# EAGLE design drone_synth (EAGLE 5.07)
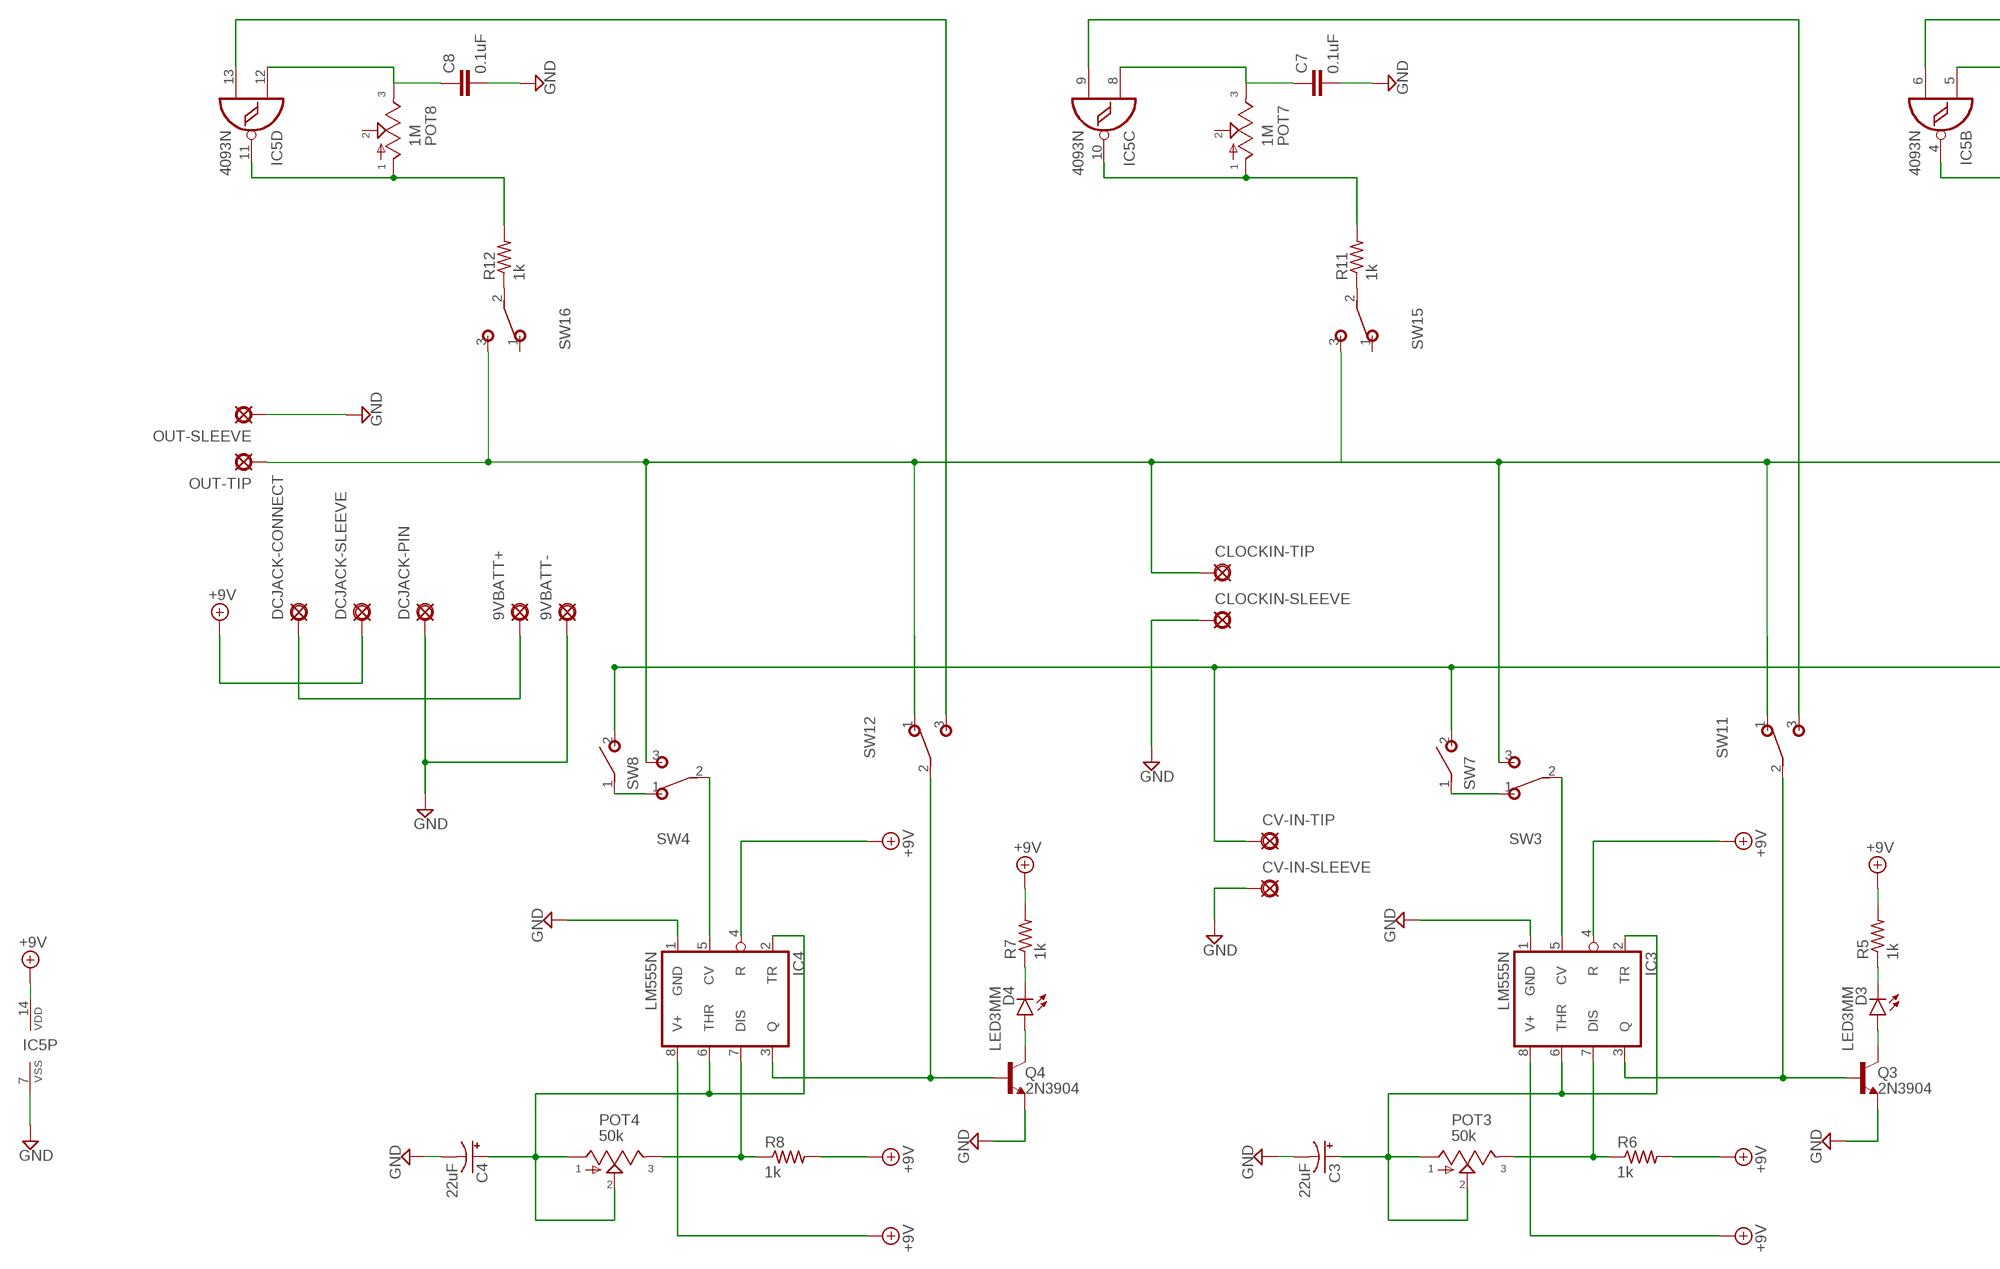
[diagram p0: schematic, sheet 1, part 1 of 2]
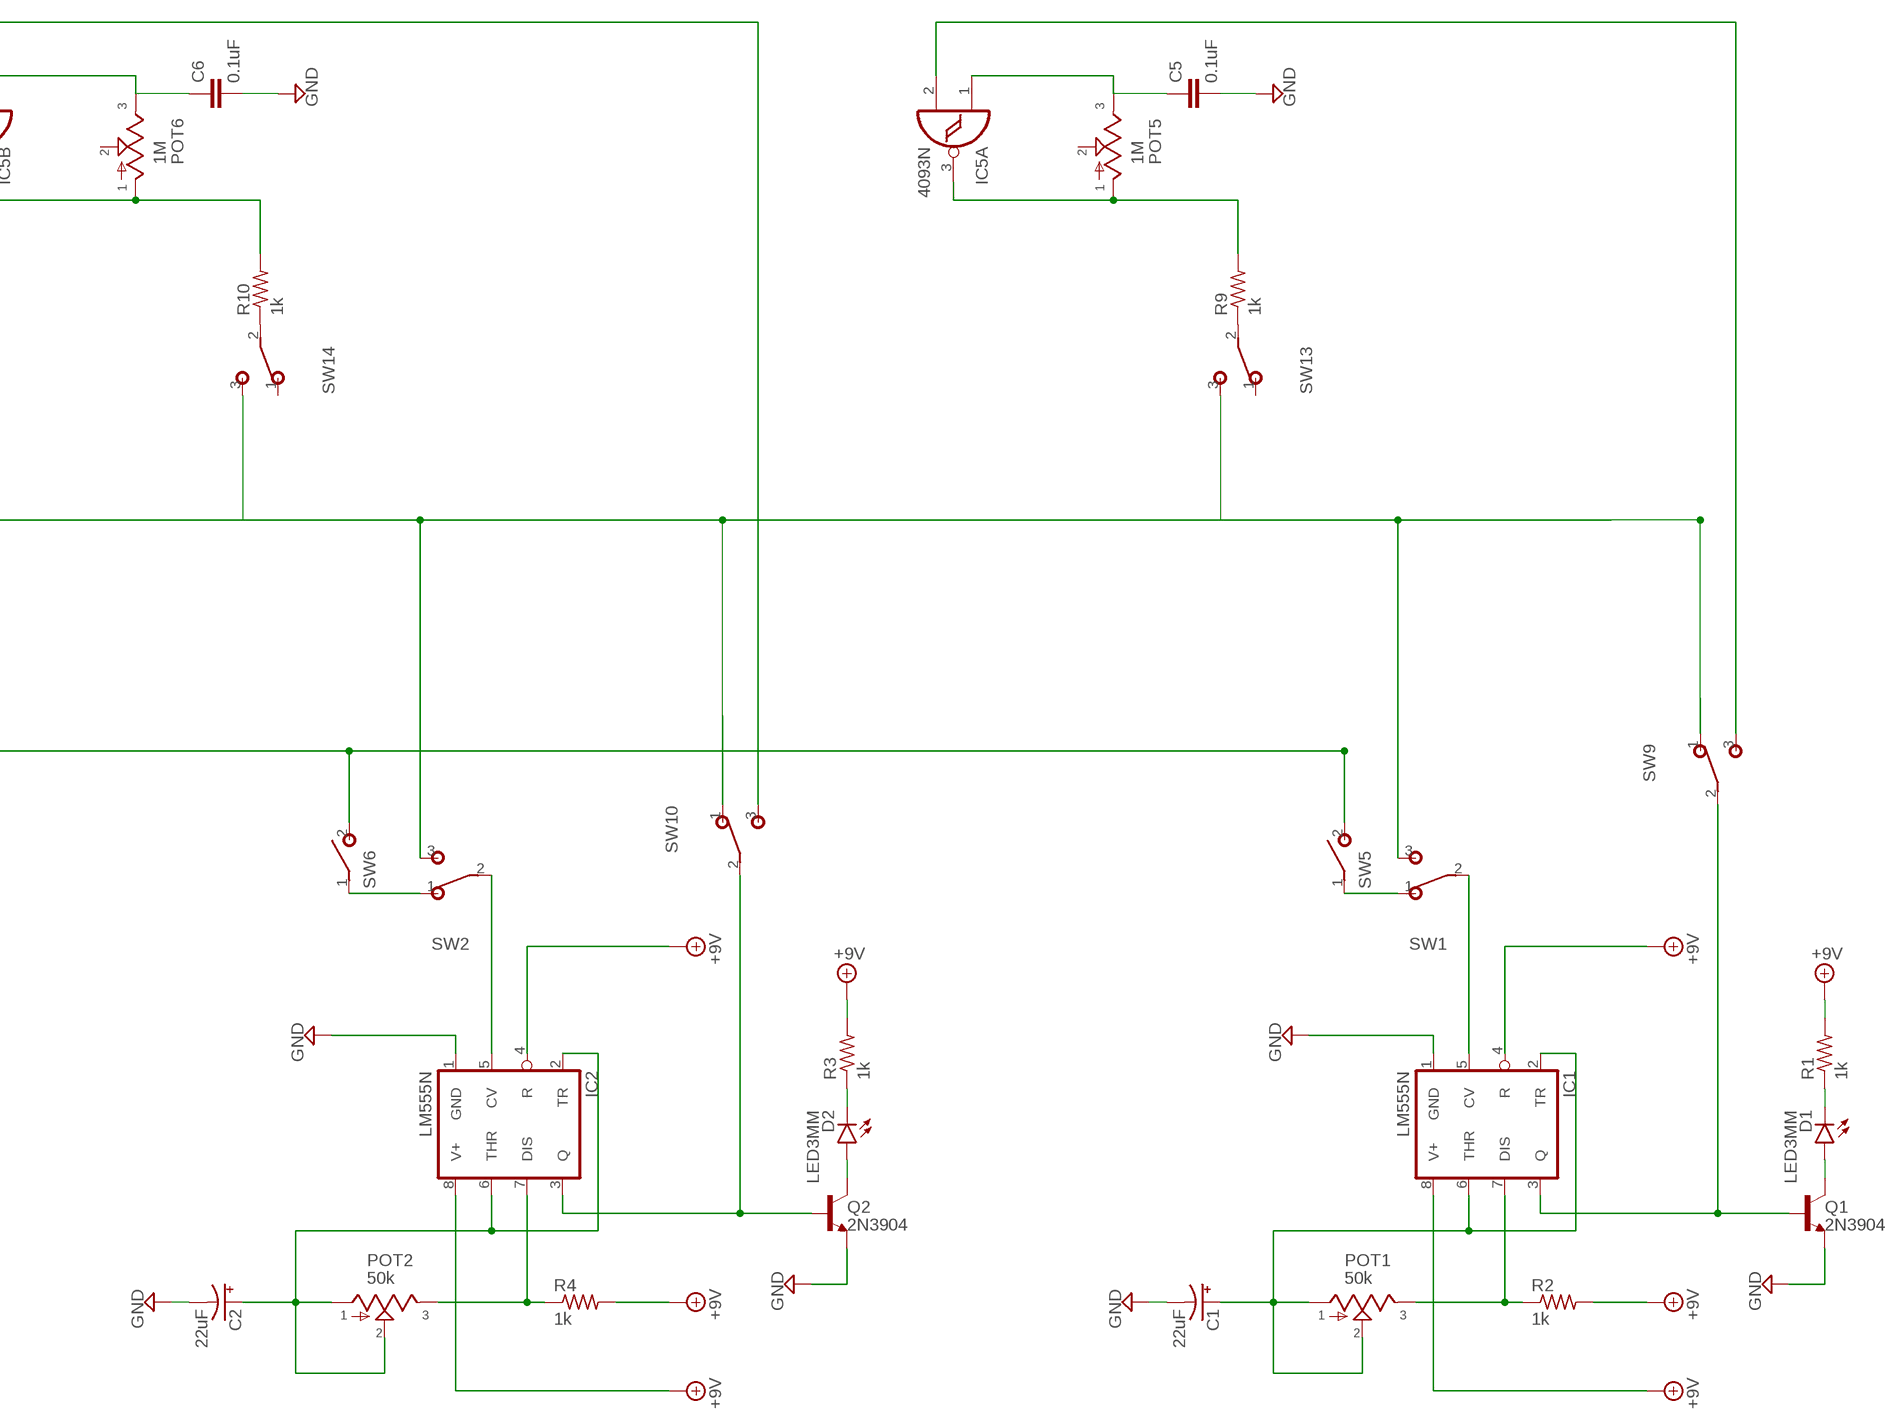
[diagram p1: schematic, sheet 1, part 2 of 2]

## Parts
9VBATT+  PAD8  [OCTOGON]
9VBATT-  PAD  [SQUARE]
C1  22uF  0501  [050_020_1]
C2  22uF  0501  [050_020_1]
C3  22uF  0501  [050_020_1]
C4  22uF  0501  [050_020_1]
C5  0.1uF  050X030_0251  [050X030_025]
C6  0.1uF  050X030_0251  [050X030_025]
C7  0.1uF  050X030_0251  [050X030_025]
C8  0.1uF  050X030_0251  [050X030_025]
CLOCKIN-SLEEVE  PAD8  [OCTOGON]
CLOCKIN-TIP  PAD  [SQUARE]
CV-IN-SLEEVE  PAD8  [OCTOGON]
CV-IN-TIP  PAD  [SQUARE]
D1  LED3MM  [LED3MM]
D2  LED3MM  [LED3MM]
D3  LED3MM  [LED3MM]
D4  LED3MM  [LED3MM]
DCJACK-CONNECT  PAD8  [OCTOGON]
DCJACK-PIN  PAD  [SQUARE]
DCJACK-SLEEVE  PAD8  [OCTOGON]
IC1  LM555N  [DIL08]
IC2  LM555N  [DIL08]
IC3  LM555N  [DIL08]
IC4  LM555N  [DIL08]
IC5  4093N  [DIL14]
OUT-SLEEVE  PAD8  [OCTOGON]
OUT-TIP  PAD  [SQUARE]
POT1  50k  POT  [POT]
POT2  50k  POT  [POT]
POT3  50k  POT  [POT]
POT4  50k  POT  [POT]
POT5  1M  POT  [POT]
POT6  1M  POT  [POT]
POT7  1M  POT  [POT]
POT8  1M  POT  [POT]
Q1  2N3904  [TO92-]
Q2  2N3904  [TO92-]
Q3  2N3904  [TO92-]
Q4  2N3904  [TO92-]
R1  1k  3MM.2  [R0204/2]
R2  1k  3MM.2  [R0204/2]
R3  1k  3MM.2  [R0204/2]
R4  1k  3MM.2  [R0204/2]
R5  1k  3MM.2  [R0204/2]
R6  1k  3MM.2  [R0204/2]
R7  1k  3MM.2  [R0204/2]
R8  1k  3MM.2  [R0204/2]
R9  1k  3MM.2  [R0204/2]
R10  1k  3MM.2  [R0204/2]
R11  1k  3MM.2  [R0204/2]
R12  1k  3MM.2  [R0204/2]
SW1  SPDTPADS  [SPDT]
SW2  SPDTPADS  [SPDT]
SW3  SPDTPADS  [SPDT]
SW4  SPDTPADS  [SPDT]
SW5  SPST  [SPST]
SW6  SPST  [SPST]
SW7  SPST  [SPST]
SW8  SPST  [SPST]
SW9  SPDTPADS  [SPDT]
SW10  SPDTPADS  [SPDT]
SW11  SPDTPADS  [SPDT]
SW12  SPDTPADS  [SPDT]
SW13  SPDTPADS  [SPDT]
SW14  SPDTPADS  [SPDT]
SW15  SPDTPADS  [SPDT]
SW16  SPDTPADS  [SPDT]

## Nets
+9V: DCJACK-SLEEVE.1(PAD) IC1.4(R) IC1.8(V+) IC2.4(R) IC2.8(V+) IC3.4(R) IC3.8(V+) IC4.4(R) IC4.8(V+) IC5.14(P:VDD) R1.2 R2.2 R3.2 R4.2 R5.2 R6.2 R7.2 R8.2
D2: D2.A Q2.1(C)
D4: D4.A Q4.1(C)
GND: 9VBATT-.1(PAD) C1.- C2.- C3.- C4.- C5.2 C6.2 C7.2 C8.2 CLOCKIN-SLEEVE.1(PAD) CV-IN-SLEEVE.1(PAD) DCJACK-PIN.1(PAD) IC1.1(GND) IC2.1(GND) IC3.1(GND) IC4.1(GND) IC5.7(P:VSS) OUT-SLEEVE.1(PAD) Q1.3(E) Q2.3(E) Q3.3(E) Q4.3(E)
N$1: D1.K(C) R1.1
N$2: C1.+ IC1.2(TR) IC1.6(THR) POT1.1 POT1.2
N$3: IC1.7(DIS) POT1.3 R2.1
N$4: D1.A Q1.1(C)
N$5: IC1.3(Q) Q1.2(B) SW9.2(P)
N$6: C5.1 IC5.1(A:I0) POT5.3
N$7: IC1.5(CV) SW1.2(P)
N$8: IC5.3(A:O) POT5.1 R9.2
N$9: R9.1 SW13.2(P)
N$10: 9VBATT+.1(PAD) DCJACK-CONNECT.1(PAD)
N$11: CV-IN-TIP.1(PAD) SW5.2(S) SW6.2(S) SW7.2(S) SW8.2(S)
N$12: SW1.1(O) SW5.1(P)
N$13: SW2.1(O) SW6.1(P)
N$14: SW3.1(O) SW7.1(P)
N$15: SW4.1(O) SW8.1(P)
N$19: C2.+ IC2.2(TR) IC2.6(THR) POT2.1 POT2.2
N$42: IC2.7(DIS) POT2.3 R4.1
N$44: IC5.2(A:I1) SW9.3(S)
N$45: D2.K(C) R3.1
N$47: IC2.3(Q) Q2.2(B) SW10.2(P)
N$48: IC2.5(CV) SW2.2(P)
N$49: C6.1 IC5.5(B:I0) POT6.3
N$50: IC5.4(B:O) POT6.1 R10.2
N$51: R10.1 SW14.2(P)
N$53: IC5.6(B:I1) SW10.3(S)
N$54: C3.+ IC3.2(TR) IC3.6(THR) POT3.1 POT3.2
N$55: IC3.7(DIS) POT3.3 R6.1
N$56: D3.K(C) R5.1
N$57: D3.A Q3.1(C)
N$58: IC3.3(Q) Q3.2(B) SW11.2(P)
N$59: IC3.5(CV) SW3.2(P)
N$60: C7.1 IC5.8(C:I0) POT7.3
N$61: IC5.10(C:O) POT7.1 R11.2
N$62: R11.1 SW15.2(P)
N$64: IC5.9(C:I1) SW11.3(S)
N$65: C4.+ IC4.2(TR) IC4.6(THR) POT4.1 POT4.2
N$66: IC4.7(DIS) POT4.3 R8.1
N$67: D4.K(C) R7.1
N$69: IC4.3(Q) Q4.2(B) SW12.2(P)
N$70: IC4.5(CV) SW4.2(P)
N$71: C8.1 IC5.12(D:I0) POT8.3
N$72: IC5.11(D:O) POT8.1 R12.2
N$73: R12.1 SW16.2(P)
N$75: IC5.13(D:I1) SW12.3(S)
N$77: CLOCKIN-TIP.1(PAD) OUT-TIP.1(PAD) SW1.3(S) SW2.3(S) SW3.3(S) SW4.3(S) SW9.1(O) SW10.1(O) SW11.1(O) SW12.1(O) SW13.3(S) SW14.3(S) SW15.3(S) SW16.3(S)
Unconnected: POT5.2 POT6.2 POT7.2 POT8.2 SW13.1(O) SW14.1(O) SW15.1(O) SW16.1(O)

## Library data of the parts
9VBATT+ 9VBATT- CLOCKIN-SLEEVE CLOCKIN-TIP CV-IN-SLEEVE CV-IN-TIP DCJACK-CONNECT DCJACK-PIN DCJACK-SLEEVE OUT-SLEEVE OUT-TIP = gm-supply:PAD: PAD use this package for pads with any purpose, including input, output, send or return various pad shapes: round, square, octogonal, long, and long offset
C1-C4 = gm-caps-electro-pol:050: 0.22 - 100uF Xicon values at Mouser.com: 10V: 10 - 100uF; 16V: 2.2 - 47uF; 25V: 0.47 - 47uF; 50V: 0.22 - 22uF
C5-C8 = gm-caps-ceramic:050X030_025: 47 - 120pF Xicon Ceramic Disc 2.5mm lead spacing
D1-D4 = gm-diodes:LED
IC1-IC4 = linear:*555: TIMER
IC5 = 40xx:4093: Quad 2-input NAND schmitt trigger
POT1-POT8 = gm-pots:POT: Potentiometers the arrow indicates the clockwise motion of th wiper (lug 2) fully counter clockwise there is no resistance between lugs 1 and 2 fully clockwise the resistance between lugs 1 and 2 is the value of the pot
Q1-Q4 = gm-trans:2N3904: NPN Transistor
R1-R12 = gm-resistors:3MM: 3mm Resistors Leads spaced 1-6 holes apart for 0.1" perfboard. Suitable for 1/8 watt resistors.
SW1-SW4 SW9-SW16 = gm-switches:SPDT: TOGGLE SWITCH Marquardt
SW5-SW8 = gm-switches:SPST

## Board
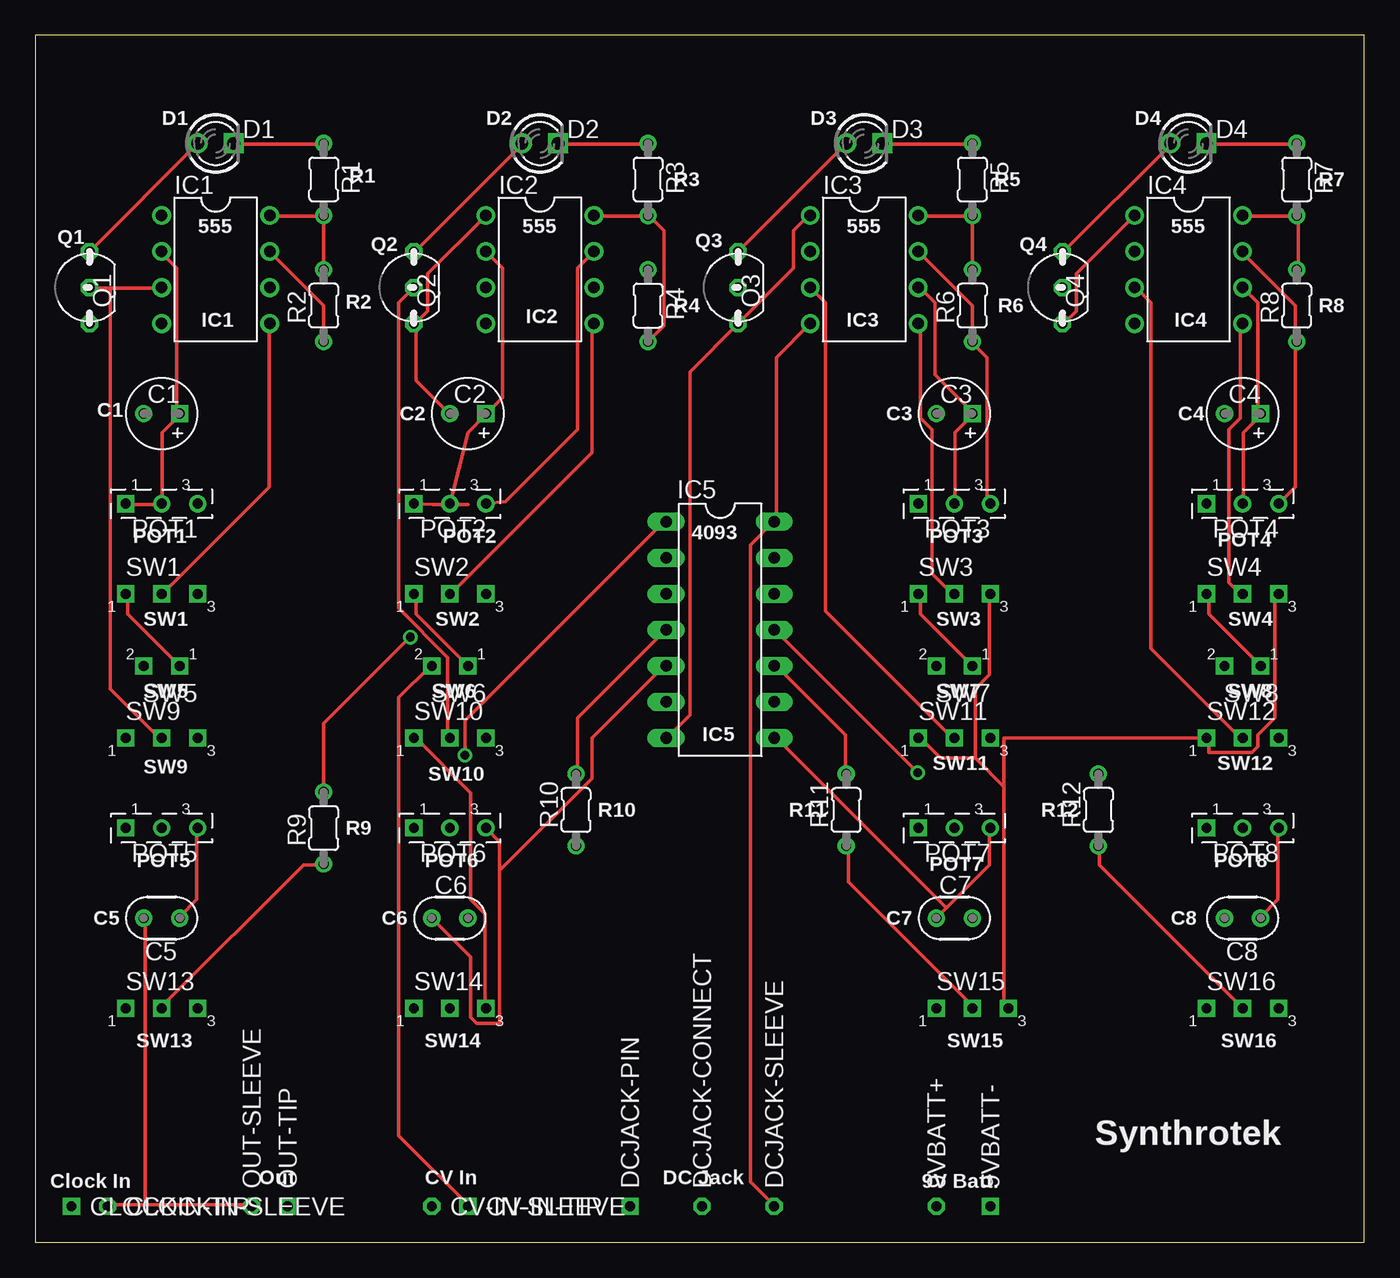
[diagram p2: board, top side]
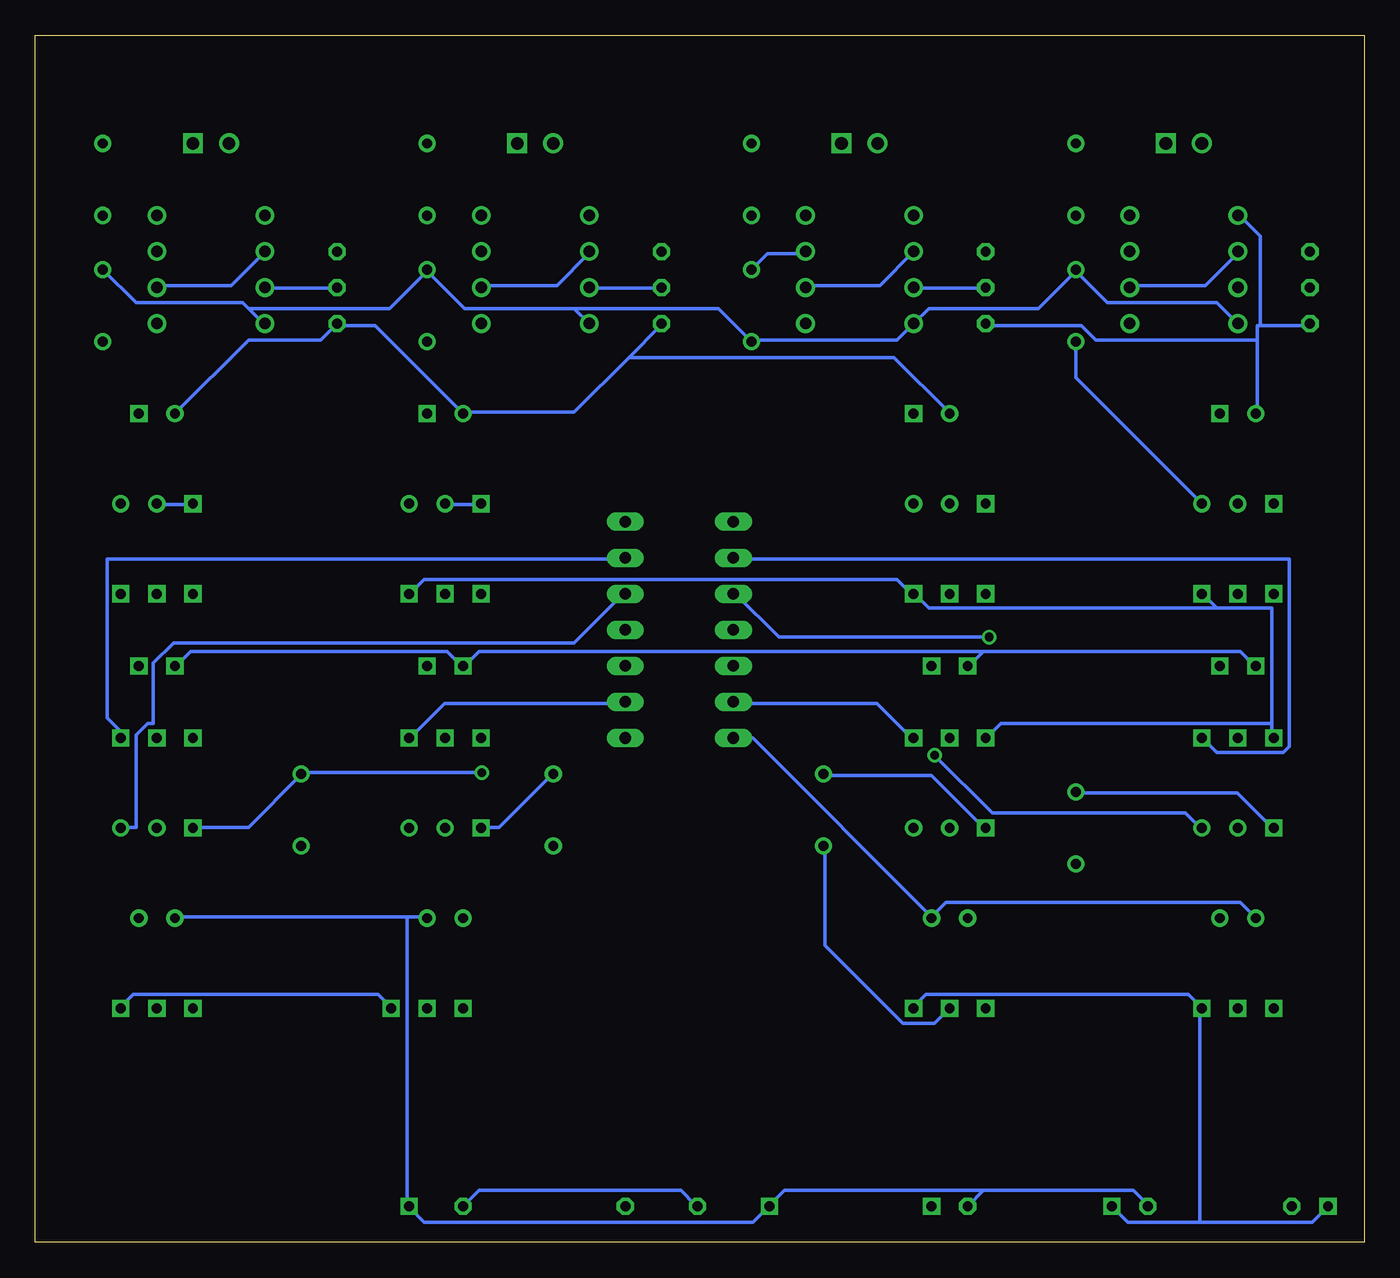
[diagram p3: board, bottom side, seen from below]

Size 93.65 x 85.08 mm. Coordinates in mm from the lower left corner, seen from the top.
Outline: 0,0 93.65,0 93.65,85.08 0,85.08 0,0
Copper layers (1*16): Top 0.035mm / dielectric 1.5mm / Bottom 0.035mm
Design rules "default": minimum track width 10mil, minimum drill 24mil, track to track 8mil, track to pad 8mil, pad to pad 8mil, via to via 8mil, smd to smd 8mil, copper to edge 40mil, drill to drill 8mil, minimum pad ring 10mil, minimum via ring 8mil, stop-mask expansion 4mil, vias tented up to drill 0mil, thermal gap 10mil

### Footprints (pad centres in the part's own frame; a part is rotated, then mirrored left to right if it is on the bottom)
OCTOGON = drill 0.7 octagon: 1 0,0
SQUARE = drill 0.7 square: 1 0,0
050_020_1 = drill 0.7 square: + -1.27,0 | drill 0.7 round: - 1.27,0
050X030_025 = drill 0.7 round: 1 -1.27,0; 2 1.27,0
LED3MM = drill 0.9 round: A -1.27,0 | drill 0.9 square: K 1.27,0
DIL08 = drill 0.813 pad 1.27 round: 1 -3.81,-3.81; 2 -1.27,-3.81; 3 1.27,-3.81; 4 3.81,-3.81; 5 3.81,3.81; 6 1.27,3.81; 7 -1.27,3.81; 8 -3.81,3.81
DIL14 = drill 0.813 long: 1 -7.62,-3.81; 2 -5.08,-3.81; 3 -2.54,-3.81; 4 0,-3.81; 5 2.54,-3.81; 6 5.08,-3.81; 7 7.62,-3.81; 8 7.62,3.81; 9 5.08,3.81; 10 2.54,3.81; 11 0,3.81; 12 -2.54,3.81; 13 -5.08,3.81; 14 -7.62,3.81
POT = drill 0.7 square: 1 2.54,0 | drill 0.7 round: 2 0,0; 3 -2.54,0
TO92- = drill 0.7 octagon: 1 2.54,0; 2 0,0; 3 -2.54,0
R0204/2 = drill 0.7 round: 1 -2.54,0; 2 2.54,0
SPDT = drill 0.7 square: 1 -2.54,0; 2 0,0; 3 2.54,0
SPST = drill 0.7 square: 1 -1.27,0; 2 1.27,0

### Placement (x,y rotation side)
9VBATT+  63.5,2.54 90 top
9VBATT-  67.31,2.54 90 top
C1  8.89,58.42 180 top
C2  30.48,58.42 180 top
C3  64.77,58.42 180 top
C4  85.09,58.42 180 top
C5  8.89,22.86 180 top
C6  29.21,22.86 0 top
C7  64.77,22.86 0 top
C8  85.09,22.86 180 top
CLOCKIN-SLEEVE  5.08,2.54 0 top
CLOCKIN-TIP  2.54,2.54 0 top
CV-IN-SLEEVE  27.94,2.54 0 top
CV-IN-TIP  30.48,2.54 0 top
D1  12.7,77.47 0 top
D2  35.56,77.47 0 top
D3  58.42,77.47 0 top
D4  81.28,77.47 0 top
DCJACK-CONNECT  46.99,2.54 90 top
DCJACK-PIN  41.91,2.54 90 top
DCJACK-SLEEVE  52.07,2.54 90 top
IC1  12.7,68.58 270 top
IC2  35.56,68.58 270 top
IC3  58.42,68.58 270 top
IC4  81.28,68.58 270 top
IC5  48.26,43.18 270 top
OUT-SLEEVE  15.24,2.54 90 top
OUT-TIP  17.78,2.54 90 top
POT1  8.89,52.07 180 top
POT2  29.21,52.07 180 top
POT3  64.77,52.07 180 top
POT4  85.09,52.07 180 top
POT5  8.89,29.21 180 top
POT6  29.21,29.21 180 top
POT7  64.77,29.21 180 top
POT8  85.09,29.21 180 top
Q1  3.81,67.31 90 top
Q2  26.67,67.31 90 top
Q3  49.53,67.31 90 top
Q4  72.39,67.31 90 top
R1  20.32,74.93 270 top
R2  20.32,66.04 90 top
R3  43.18,74.93 270 top
R4  43.18,66.04 270 top
R5  66.04,74.93 270 top
R6  66.04,66.04 90 top
R7  88.9,74.93 270 top
R8  88.9,66.04 90 top
R9  20.32,29.21 90 top
R10  38.1,30.48 90 top
R11  57.15,30.48 90 top
R12  74.93,30.48 90 top
SW1  8.89,45.72 0 top
SW2  29.21,45.72 0 top
SW3  64.77,45.72 0 top
SW4  85.09,45.72 0 top
SW5  8.89,40.64 180 top
SW6  29.21,40.64 180 top
SW7  64.77,40.64 180 top
SW8  85.09,40.64 180 top
SW9  8.89,35.56 0 top
SW10  29.21,35.56 0 top
SW11  64.77,35.56 0 top
SW12  85.09,35.56 0 top
SW13  8.89,16.51 0 top
SW14  29.21,16.51 0 top
SW15  66.04,16.51 0 top
SW16  85.09,16.51 0 top

### Tracks (layer width: path | path; a pad name or v marks a point on that pad's centre or on a via)
+9V
  Top 0.254: R2.2 20.32,72.34 | 20.32,72.34 16.66,72.34 IC1.8 | 20.32,72.34 R1.2 | R4.2 44.3,64.62 44.3,71.32 43.28,72.34 R3.2 43.08,72.34 39.42,72.34 IC2.8 | R6.2 66.04,72.34 | 66.04,72.34 62.38,72.34 IC3.8 | 66.04,72.34 R5.2 | R8.2 89,68.68 89,72.34 R7.2 88.8,72.34 85.14,72.34 IC4.8 | DCJACK-SLEEVE.1 52.02,2.64 50.39,4.27 50.39,49.17 52.02,50.8 IC5.14 52.22,50.8 52.22,62.38 IC3.4
  Bottom 0.254: 20.32,68.48 18.09,66.24 10.36,66.24 IC1.4 | 20.32,68.48 22.96,65.84 30.68,65.84 IC2.4 32.92,63.6 43.08,63.6 R4.2 45.52,65.84 55.68,65.84 | 20.32,68.48 R2.2 | 78.64,65.84 79.05,66.24 86.56,66.24 R8.2 | 78.64,65.84 77.62,64.82 IC4.4 | 66.04,68.48 68.68,65.84 78.64,65.84 | 66.04,68.48 63.4,65.84 55.68,65.84 | 66.04,68.48 R6.2 | IC3.4 55.68,65.84
D2
  Top 0.254: Q2.1 26.82,69.9 34.14,77.22 34.14,77.42 D2.A
D4
  Top 0.254: Q4.1 72.54,69.9 79.86,77.22 79.86,77.42 D4.A
GND
  Top 0.254: C2.- 29.06,58.52 26.82,60.76 26.82,64.62 Q2.3 26.82,64.82 27.64,65.63 27.64,68.28 IC2.1 | IC3.1 54.46,72.34 53.44,71.32 53.44,68.68 Q3.3 46.13,61.37 46.13,37.19 44.5,35.56 IC5.7 | IC4.1 73.36,68.28 73.36,65.63 72.54,64.82 Q4.3 | 7.72,2.64 15.24,2.64 OUT-SLEEVE.1 | 7.72,2.64 5.08,2.64 CLOCKIN-SLEEVE.1 | 7.72,2.64 7.72,22.76 C5.2
  Bottom 0.254: 7.52,63.6 7.52,64.62 7.32,64.62 | 7.52,63.6 7.52,58.52 C1.- | 7.32,64.62 3.86,64.62 Q1.3 | 7.32,64.62 7.32,70.92 8.74,72.34 IC1.1 | 7.52,63.6 18.9,63.6 19.91,64.62 26.62,64.62 Q2.3 | C4.- 78.64,63.6 73.56,63.6 Q4.3 72.34,64.62 69.7,64.62 C3.- 63.4,58.52 55.68,58.52 51.82,62.38 | 51.82,62.38 49.58,64.62 Q3.3 | 51.82,62.38 33.12,62.38 29.26,58.52 C2.- | 67.46,22.96 83.72,22.96 C8.2 | 67.46,22.96 66.04,22.96 C7.2 | 67.46,22.96 67.46,2.64 9VBATT-.1 67.26,2.44 66.24,1.42 43.08,1.42 42.06,2.44 DCJACK-PIN.1 41.86,2.64 40.84,3.66 26.82,3.66 | 30.48,22.96 43.08,35.56 IC5.7 | 26.82,3.66 16.26,3.66 15.24,2.64 OUT-SLEEVE.1 | 26.82,3.66 CV-IN-SLEEVE.1 | 30.48,22.96 29.46,23.98 8.74,23.98 C5.2 | 30.48,22.96 C6.2
N$1
  Top 0.254: R1.1 20.32,77.42 14.02,77.42 D1.K
N$2
  Top 0.254: POT1.1 6.5,52.02 8.74,52.02 POT1.2 8.94,52.22 8.94,57.1 10.16,58.32 C1.+ 10.16,58.52 9.96,58.73 9.96,68.68 8.94,69.7 IC1.2
  Bottom 0.254: IC1.2 8.94,69.7 11.18,67.46 16.46,67.46 IC1.6
N$3
  Top 0.254: IC1.7 20.32,66.04 R2.1
  Bottom 0.254: POT1.3 20.32,60.96 R2.1
N$4
  Top 0.254: Q1.1 D1.A
N$5
  Top 0.254: 5.28,67.26 8.74,67.26 IC1.3 | 5.28,67.26 3.86,67.26 Q1.2 | 5.28,67.26 5.28,39.01 8.74,35.56 SW9.2
N$6  (via drill 0.61)
  Top 0.254: C5.1 10.16,22.96 11.38,24.18 11.38,29.06 POT5.3 | v30.28,34.34 30.28,36.78 44.3,50.8 IC5.1
  Bottom 0.254: v30.28,34.34 26.21,30.28 12.6,30.28 11.58,29.26 POT5.3
N$7
  Top 0.254: SW1.2 8.94,45.72 16.46,53.24 16.46,64.62 IC1.5
N$8  (via drill 0.61)
  Top 0.254: v26.42,42.67 20.32,36.58 R9.2
  Bottom 0.254: POT5.1 6.5,29.26 8.94,31.7 20.32,31.7 R9.2 | v26.42,42.67 41.25,42.67 44.3,45.72 IC5.3
N$9
  Top 0.254: SW13.2 8.94,16.66 18.9,26.62 20.32,26.62 R9.1
N$10
  Bottom 0.254: DCJACK-CONNECT.1 47.14,2.64 48.16,3.66 62.38,3.66 9VBATT+.1
N$11
  Top 0.254: CV-IN-TIP.1 30.48,2.64 25.6,7.52 25.6,38.41 27.84,40.64 SW6.2
  Bottom 0.254: SW8.2 83.72,40.64 82.7,41.66 64.62,41.66 63.6,40.64 SW7.2 63.4,40.64 62.38,41.66 26.82,41.66 | 26.82,41.66 8.74,41.66 7.72,40.64 SW5.2 | 26.82,41.66 27.84,40.64 SW6.2
N$12
  Top 0.254: SW5.1 6.5,44.3 6.5,45.72 SW1.1
N$13
  Top 0.254: SW6.1 26.82,44.3 26.82,45.72 SW2.1
N$14
  Top 0.254: SW7.1 62.38,44.3 62.38,45.72 SW3.1
N$15
  Top 0.254: SW8.1 82.7,44.3 82.7,45.72 SW4.1
N$19
  Top 0.254: POT2.1 28.04,52.02 30.48,52.02 POT2.2 30.48,57.1 31.7,58.32 C2.+ 31.9,58.52 32.92,59.54 32.92,68.68 IC2.2
  Bottom 0.254: IC2.2 34.14,67.46 39.22,67.46 IC2.6
N$42
  Top 0.254: POT2.3 33.12,52.22 38.2,57.3 38.2,68.68 IC2.7
  Bottom 0.254: R4.1 42.06,69.7 39.42,69.7 IC2.7
N$44
  Bottom 0.254: SW9.3 11.38,35.56 10.36,34.54 5.69,34.54 5.28,34.95 5.28,48.16 44.3,48.16 IC5.2
N$45
  Top 0.254: R3.1 43.08,77.42 36.98,77.42 D2.K
N$47
  Top 0.254: SW10.2 29.06,35.56 29.06,41.25 25.6,44.7 25.6,66.24 Q2.2
  Bottom 0.254: IC2.3 31.7,67.26 26.82,67.26 Q2.2
N$48
  Top 0.254: SW2.2 29.26,45.72 39.22,55.68 39.22,64.62 IC2.5
N$49
  Top 0.254: 32.72,26.21 32.72,28.25 POT6.3 | 32.72,26.21 32.72,15.44 31.09,15.44 30.68,15.85 30.68,20.12 C6.1 | 32.72,26.21 39.22,32.72 39.22,35.56 44.3,40.64 IC5.5
N$50
  Top 0.254: IC5.4 44.3,43.08 38.2,36.98 38.2,33.12 R10.2
  Bottom 0.254: POT6.1 26.82,29.26 30.48,32.92 38,32.92 R10.2
N$51
  Bottom 0.254: SW14.2 30.28,15.44 32.51,15.44 38,20.93 38,27.84 R10.1
N$53
  Bottom 0.254: SW10.3 31.9,35.56 34.34,38 44.3,38 IC5.6
N$54
  Top 0.254: POT3.2 64.82,52.22 64.82,57.1 66.04,58.32 C3.+ 66.04,58.52 63.4,61.16 63.4,66.24 62.38,67.26 IC3.6
  Bottom 0.254: POT3.1 62.38,52.02 64.62,52.02 POT3.2 | IC3.2 54.66,69.7 56.9,67.46 62.18,67.46 IC3.6
N$55
  Top 0.254: POT3.3 67.26,52.22 67.06,52.43 67.06,62.38 66.04,63.4 R6.1 66.04,66.04 IC3.7
N$56
  Top 0.254: R5.1 66.04,77.42 59.74,77.42 D3.K
N$57
  Top 0.254: Q3.1 D3.A
N$58
  Top 0.254: SW11.2 64.62,35.56 55.68,44.5 55.68,66.24 IC3.3
  Bottom 0.254: Q3.2 49.58,67.26 54.46,67.26 IC3.3
N$59
  Top 0.254: SW3.2 64.62,45.72 63.2,47.14 63.2,57.3 62.38,58.12 62.38,64.62 IC3.5
N$60
  Top 0.254: 64.21,23.57 67.26,26.62 67.26,29.06 POT7.3 | 64.21,23.57 C7.1 | 64.21,23.57 52.22,35.56 IC5.8
N$61
  Top 0.254: IC5.10 52.22,40.64 57.1,35.76 57.1,33.12 R11.2
  Bottom 0.254: R11.2 57.3,32.92 60.96,29.26 62.18,29.26 POT7.1
N$62
  Top 0.254: SW15.2 66.04,16.66 57.3,25.4 57.3,27.84 R11.1
N$64
  Bottom 0.254: SW11.3 67.26,35.56 64.82,38 52.22,38 IC5.9
N$65
  Top 0.254: POT4.2 85.14,52.22 85.14,57.1 86.36,58.32 C4.+ 86.36,58.52 86.16,58.73 86.16,66.24 IC4.6
  Bottom 0.254: POT4.1 82.7,52.02 84.94,52.02 POT4.2 | IC4.2 79.86,67.46 84.94,67.46 IC4.6
N$66
  Top 0.254: POT4.3 88.8,53.24 88.8,63.4 R8.1 88.8,63.6 88.8,66.04 85.14,69.7 IC4.7
N$67
  Top 0.254: R7.1 88.8,77.42 82.7,77.42 D4.K
N$69
  Top 0.254: SW12.2 84.94,35.56 78.64,41.86 78.64,66.24 77.62,67.26 IC4.3
  Bottom 0.254: Q4.2 72.54,67.26 77.42,67.26 IC4.3
N$70
  Top 0.254: SW4.2 84.94,45.72 84.12,46.53 84.12,57.3 84.94,58.12 84.94,64.62 IC4.5
N$71
  Top 0.254: C8.1 86.36,22.96 87.58,24.18 87.58,29.06 POT8.3
  Bottom 0.254: IC5.12 52.22,45.72 55.68,42.27 83.92,42.27 85.34,40.84 85.34,36.58 85.75,36.58 86.56,35.76 86.56,29.26 87.58,29.26 POT8.3
N$72  (via drill 0.61)
  Top 0.254: v62.18,33.12 52.22,43.08 IC5.11
  Bottom 0.254: POT8.1 82.5,29.26 78.64,29.26 74.98,32.92 R12.2 74.78,33.12 v62.18,33.12
N$73
  Top 0.254: SW16.2 74.98,26.62 74.98,27.84 R12.1
N$75
  Bottom 0.254: SW12.3 87.78,35.56 87.78,36.17 88.59,36.98 88.59,48.16 52.22,48.16 IC5.13
N$77
  Top 0.254: 66.24,34.14 63.8,34.14 62.38,35.56 SW11.1 | 66.24,34.14 66.24,39.01 67.26,40.03 67.26,45.72 SW3.3 | 68.28,32.11 68.28,16.87 68.48,16.66 SW15.3 | 66.24,34.14 68.28,32.11 | 68.28,32.11 68.28,35.56 SW12.1 82.7,35.56 82.7,34.54 85.75,34.54 86.16,34.95 86.16,35.76 87.38,36.98 87.38,45.52 87.58,45.72 SW4.3 | SW10.1 26.82,35.56 30.68,31.7 30.68,24.18 31.7,23.16 31.7,16.66 SW14.3
  Bottom 0.254: SW16.3 87.58,16.66 86.77,17.48 69.49,17.48 68.68,16.66 SW15.3 | 6.5,36.58 6.5,44.7 10.36,44.7 | 6.5,36.58 6.5,35.56 SW9.1 | 10.36,44.7 11.38,45.72 SW1.3 | 6.5,36.58 25.6,36.58 26.62,35.56 SW10.1 | 10.36,44.7 30.68,44.7 31.7,45.72 SW2.3 31.9,45.72 32.92,46.74 66.24,46.74 67.26,45.72 SW3.3 | 11.58,1.42 16.66,1.42 OUT-TIP.1 | 11.58,1.42 3.66,1.42 CLOCKIN-TIP.1 | 11.58,1.42 11.58,16.46 SW13.3 12.39,17.48 30.89,17.48 31.7,16.66 SW14.3

### Text on the board
tPlace: D1 | D2 | D3 | D4 | R1 | R3 | R5 | R7 | 555 | 555 | 555 | 555 | Q1 | Q2 | Q3 | Q4 | R2 | R4 | R6 | R8 | IC1 | IC2 | IC3 | IC4 | C1 | C2 | C3 | C4 | 4093 | POT1 | POT2 | POT3 | POT4 | SW1 | SW2 | SW3 | SW4 | SW5 | SW6 | SW7 | SW8 | IC5 | SW9 | SW10 | SW11 | SW12 | R10 | R11 | R12 | R9 | POT5 | POT6 | POT7 | POT8 | C5 | C6 | C7 | C8 | SW13 | SW14 | SW15 | SW16 | Synthrotek | Clock In | Out | CV In | DC Jack | 9V Batt.